# EAGLE design motor driver (EAGLE 8.3.2)
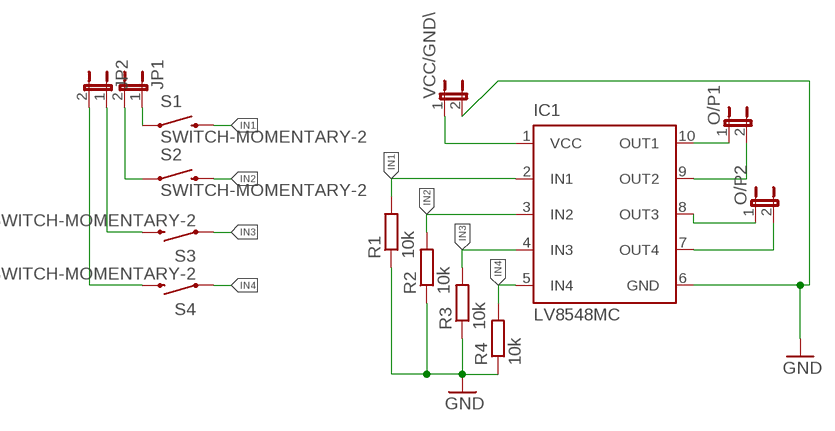
[diagram p0: schematic, sheet 1]

## Parts
IC1  LV8548MC  [MFP10S]
JP1  JP1E  [JP1]
JP2  JP1E  [JP1]
O/P1  JP1E  [JP1]
O/P2  JP1E  [JP1]
R1  10k  R-EU_R0603  [R0603]
R2  10k  R-EU_R0603  [R0603]
R3  10k  R-EU_R0603  [R0603]
R4  10k  R-EU_R0603  [R0603]
S1  SWITCH-MOMENTARY-2  [TACTILE_SWITCH_TALL]
S2  SWITCH-MOMENTARY-2  [TACTILE_SWITCH_TALL]
S3  SWITCH-MOMENTARY-2  [TACTILE_SWITCH_TALL]
S4  SWITCH-MOMENTARY-2  [TACTILE_SWITCH_TALL]
VCC/GND\  JP1E  [JP1]

## Nets
GND: IC1.6(GND) R1.1 R2.1 R3.1 R4.1 VCC/GND\.2
IN1: IC1.2(IN1) R1.2 S1.B2
IN2: IC1.3(IN2) R2.2 S2.B2
IN3: IC1.4(IN3) R3.2 S3.A2
IN4: IC1.5(IN4) R4.2 S4.A2
N$2: JP1.1 S1.A2
N$4: JP1.2 S2.A2
N$5: IC1.10(OUT1) O/P1.1
N$6: IC1.9(OUT2) O/P1.2
N$7: IC1.8(OUT3) O/P2.1
N$8: IC1.7(OUT4) O/P2.2
N$10: IC1.1(VCC) VCC/GND\.1
N$12: JP2.1 S3.B2
N$13: JP2.2 S4.B2

## Library data of the parts
IC1 = stepper_driver:LV8548MC
JP1 JP2 O/P1 O/P2 VCC/GND\ = jumper:JP1E: JUMPER
R1-R4 = resistor:R-EU_: RESISTOR, European symbol
S1-S4 = SparkFun:SWITCH-MOMENTARY-2

## Board
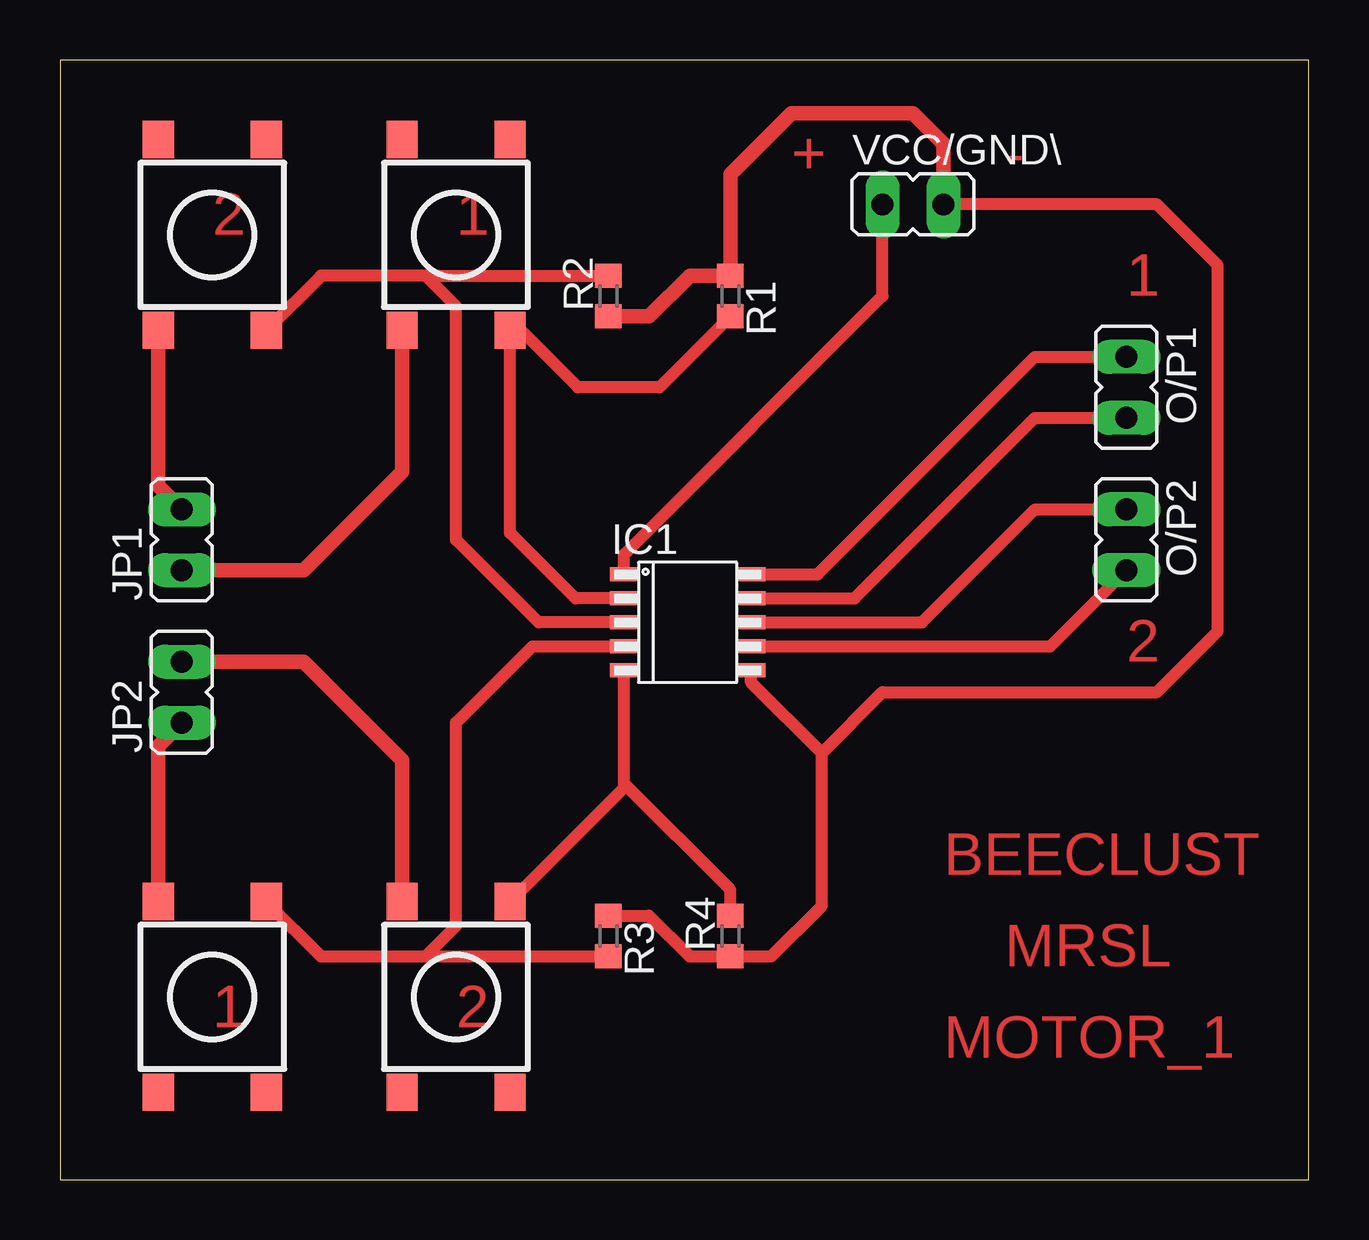
[diagram p1: board, top side]

Size 52.05 x 46.66 mm. Coordinates in mm from the lower left corner, seen from the top.
Outline: 0,0 52.05,0 52.05,46.66 0,46.66 0,0
Copper layers (1*16): Top 0.035mm / dielectric 1.5mm / Bottom 0.035mm
Design rules "default": minimum track width 6mil, minimum drill 0.35mm, track to track 6mil, track to pad 6mil, pad to pad 6mil, via to via 6mil, smd to smd 6mil, copper to edge 40mil, drill to drill 6mil, minimum pad ring 10mil, minimum via ring 8mil, stop-mask expansion 4mil, vias tented up to drill 0mil, thermal gap 10mil

### Footprints (pad centres in the part's own frame; a part is rotated, then mirrored left to right if it is on the bottom)
MFP10S = smd 1.18 x 0.58: 1 -3.16,2.37; 2 -3.16,1.37; 3 -3.16,0.37; 4 -3.16,-0.63; 5 -3.16,-1.63; 6 2.14,-1.63; 7 2.14,-0.63; 8 2.14,0.37; 9 2.14,1.37; 10 2.14,2.37
JP1 = drill 0.914 long: 1 0,-1.27; 2 0,1.27
R0603 = smd 1 x 1.1: 1 -0.85,0; 2 0.85,0
TACTILE_SWITCH_TALL = smd 1.55 x 1.3: A1 -3.975,-2.25; A2 3.975,-2.25; B1 -3.975,2.25; B2 3.975,2.25

### Placement (x,y rotation side)
IC1  26.67,22.86 0 top
JP1  5.08,26.67 0 top
JP2  5.08,20.32 0 top
O/P1  44.45,33.02 180 top
O/P2  44.45,26.67 180 top
R1  27.94,36.83 270 top
R2  22.86,36.83 90 top
R3  22.86,10.16 270 top
R4  27.94,10.16 90 top
S1  16.51,39.37 270 top
S2  6.35,39.37 270 top
S3  6.35,7.62 90 top
S4  16.51,7.62 90 top
VCC/GND\  35.56,40.64 270 top

### Tracks (layer width: path | path; a pad name or v marks a point on that pad's centre or on a via)
GND
  Top 0.508: 31.75,17.78 31.75,11.43 29.63,9.31 R4.1 26.25,9.31 24.55,11.01 R3.1 | 31.75,17.78 28.81,20.72 IC1.6 | 31.75,17.78 34.29,20.32 45.72,20.32 48.26,22.86 48.26,38.1 45.72,40.64 VCC/GND\.2
  Top 0.61: R2.1 24.55,35.98 26.25,37.68 R1.1 27.94,41.91 30.48,44.45 35.56,44.45 36.83,43.18 VCC/GND\.2
IN1
  Top 0.508: R1.2 24.98,33.02 21.59,33.02 19.21,35.4 S1.B2 18.76,26.96 21.49,24.23 IC1.2
IN2
  Top 0.508: S2.B2 10.88,37.68 15.24,37.68 | 15.24,37.68 R2.2 | IC1.3 19.95,23.23 16.51,26.67 16.51,36.41 15.24,37.68
IN3
  Top 0.508: S3.A2 10.88,9.31 15.24,9.31 | 15.24,9.31 R3.2 | 15.24,9.31 16.51,10.58 16.51,19.05 19.69,22.23 IC1.4
IN4
  Top 0.508: S4.A2 23.51,16.34 23.51,16.51 | 23.51,16.51 IC1.5 | R4.2 27.94,12.08 23.51,16.51
N$2
  Top 0.61: JP1.1 10.16,25.4 14.26,29.5 S1.A2
N$4
  Top 0.61: S2.A2 4.1,28.92 JP1.2
N$5
  Top 0.508: IC1.10 31.58,25.23 40.64,34.29 O/P1.1
N$6
  Top 0.508: IC1.9 33.12,24.23 40.64,31.75 O/P1.2
N$7
  Top 0.508: IC1.8 35.93,23.23 40.64,27.94 O/P2.1
N$8
  Top 0.508: IC1.7 41.28,22.23 O/P2.2
N$10
  Top 0.508: IC1.1 23.51,26.05 34.29,36.83 VCC/GND\.1
N$12
  Top 0.61: JP2.1 4.1,18.07 S3.B2
N$13
  Top 0.61: S4.B2 14.26,17.49 10.16,21.59 JP2.2

### Text on the board
Top: + | - | 2 | 1 | 1 | 2 | BEECLUST | MRSL | 1 | 2 | MOTOR_1